# EAGLE design Control (EAGLE 9.5.2)
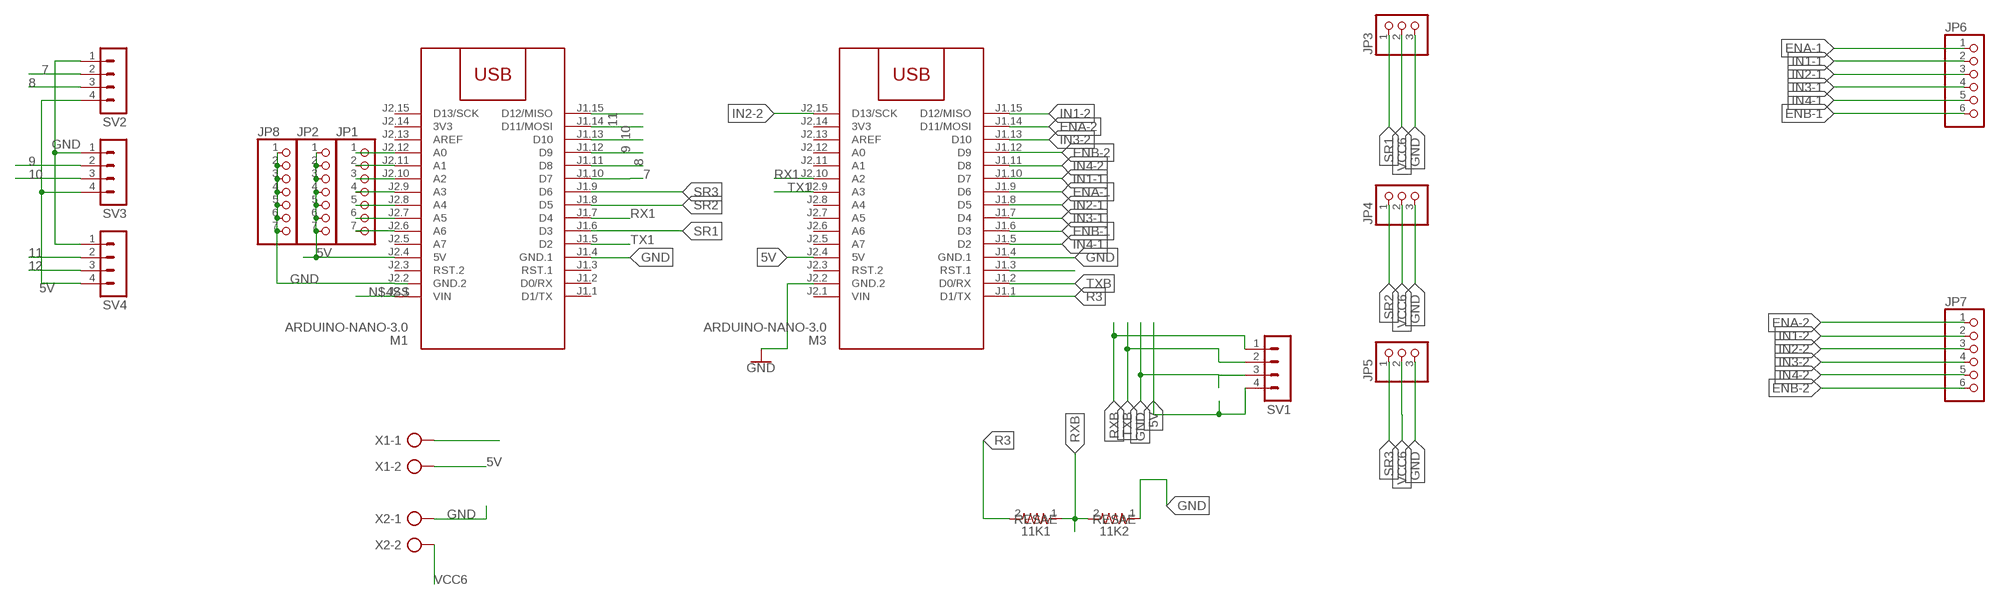
[diagram p0: schematic, sheet 1]

## Parts
11K1  RESAE  [RESAD846W63L520D250B]
11K2  RESAE  [RESAD846W63L520D250B]
JP1  PINHD-1X7  [1X07]
JP2  PINHD-1X7  [1X07]
JP3  PINHD-1X3  [1X03]
JP4  PINHD-1X3  [1X03]
JP5  PINHD-1X3  [1X03]
JP6  PINHD-1X6  [1X06]
JP7  PINHD-1X6  [1X06]
JP8  PINHD-1X7  [1X07]
M1  ARDUINO-NANO-3.0  [ARDUINO-NANO-3.0]
M3  ARDUINO-NANO-3.0  [ARDUINO-NANO-3.0]
SV1  MA04-1  [MA04-1]
SV2  MA04-1  [MA04-1]
SV3  MA04-1  [MA04-1]
SV4  MA04-1  [MA04-1]
X1  AK500/2-H  [AK500/2-H]
X2  AK500/2-H  [AK500/2-H]

## Nets
5V: JP2.1 JP2.2 JP2.3 JP2.4 JP2.5 JP2.6 JP2.7 M1.J2.4(5V) M3.J2.4(5V) SV1.4 SV2.4 SV3.4 SV4.4 X1.2
7: M1.J1.10(D7) SV2.2
8: M1.J1.11(D8) SV2.3
9: M1.J1.12(D9) SV3.2
10: M1.J1.13(D10) SV3.3
11: M1.J1.14(D11/MOSI) SV4.2
12: M1.J1.15(D12/MISO) SV4.3
ENA-1: JP6.1 M3.J1.9(D6)
ENA-2: JP7.1 M3.J1.14(D11/MOSI)
ENB-1: JP6.6 M3.J1.6(D3)
ENB-2: JP7.6 M3.J1.12(D9)
GND: 11K2.1 JP3.3 JP4.3 JP5.3 JP8.1 JP8.2 JP8.3 JP8.4 JP8.5 JP8.6 JP8.7 M1.J1.4(GND.1) M1.J2.2(GND.2) M3.J1.4(GND.1) M3.J2.2(GND.2) SV1.3 SV2.1 SV3.1 SV4.1 X1.1 X2.1
IN1-1: JP6.2 M3.J1.10(D7)
IN1-2: JP7.2 M3.J1.15(D12/MISO)
IN2-1: JP6.3 M3.J1.8(D5)
IN2-2: JP7.3 M3.J2.15(D13/SCK)
IN3-1: JP6.4 M3.J1.7(D4)
IN3-2: JP7.4 M3.J1.13(D10)
IN4-1: JP6.5 M3.J1.5(D2)
IN4-2: JP7.5 M3.J1.11(D8)
N$1: M3.J1.3(RST.1)
N$2: JP1.1 M1.J2.12(A0)
N$3: JP1.2 M1.J2.11(A1)
N$4: JP1.3 M1.J2.10(A2)
N$4SS: M1.J2.1(VIN)
N$5: JP1.4 M1.J2.9(A3)
N$6: JP1.5 M1.J2.8(A4)
N$13: JP1.6 M1.J2.7(A5)
N$14: JP1.7 M1.J2.6(A6)
R3: 11K1.2 M3.J1.1(D1/TX)
RX1: M1.J1.7(D4) M3.J2.10(A2)
RXB: 11K1.1 11K2.2 SV1.1
SR1: JP3.1 M1.J1.6(D3)
SR2: JP4.1 M1.J1.8(D5)
SR3: JP5.1 M1.J1.9(D6)
TX1: M1.J1.5(D2) M3.J2.9(A3)
TXB: M3.J1.2(D0/RX) SV1.2
VCC6: JP3.2 JP4.2 JP5.2 X2.2
Unconnected: M1.J1.1(D1/TX) M1.J1.2(D0/RX) M1.J1.3(RST.1) M1.J2.3(RST.2) M1.J2.5(A7) M1.J2.13(AREF) M1.J2.15(D13/SCK) M3.J2.3(RST.2) M3.J2.5(A7) M3.J2.6(A6) M3.J2.7(A5) M3.J2.8(A4) M3.J2.11(A1) M3.J2.12(A0) M3.J2.13(AREF)

## Power pins joined to a net without a drawn wire
3V3: M1.J2.14(3V3) M3.J2.14(3V3)
VIN: M3.J2.1(VIN)

## Library data of the parts
11K1 11K2 = SparkFun-Resistors:RESAE
JP1 JP2 JP8 = pinhead:PINHD-1X7: PIN HEADER
JP3-JP5 = pinhead:PINHD-1X3: PIN HEADER
JP6 JP7 = pinhead:PINHD-1X6: PIN HEADER
M1 M3 = diy-modules:ARDUINO-NANO-3.0: Arduino Nano 3.0 and compatible devices More details available here: https://www.arduino.cc/en/Main/ArduinoBoardNano Click here to find device on ebay.com <http://www.ebay.com/sch/arduino+nano>
SV1-SV4 = con-lstb:MA04-1: PIN HEADER; OC_FARNELL: unknown; OC_NEWARK: unknown
X1 X2 = con-ptr500:AK500/2-H: CONNECTOR Aug. 2004 / PTR Meßtechnik: Die Bezeichnung der Serie AK505 wurde geändert. Es handelt sich hierbei um AK500 in horizontaler Ausführung.; OC_FARNELL: unknown; OC_NEWARK: unknown

## Board
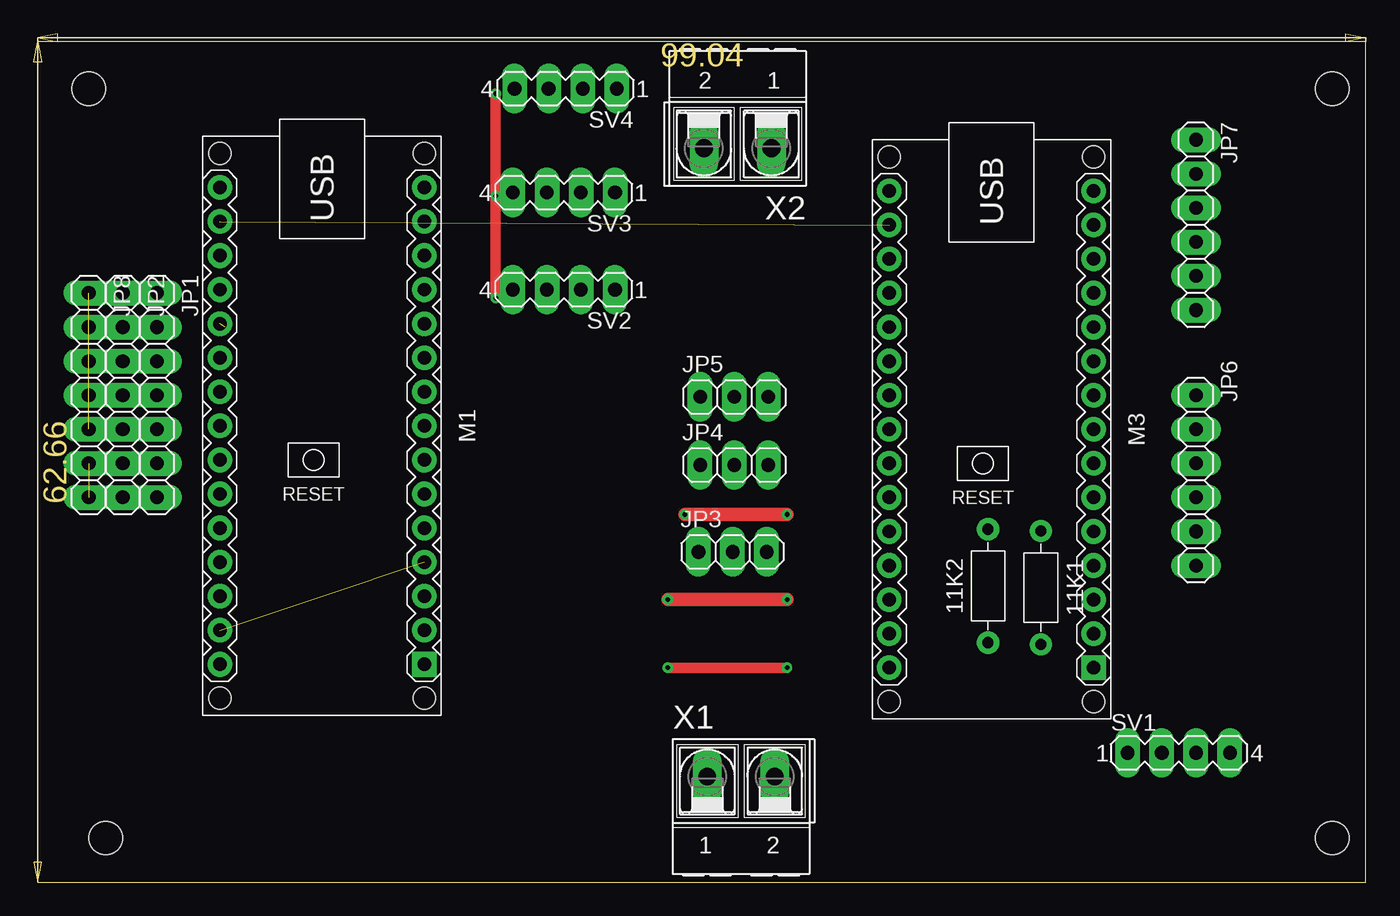
[diagram p1: board, top side]
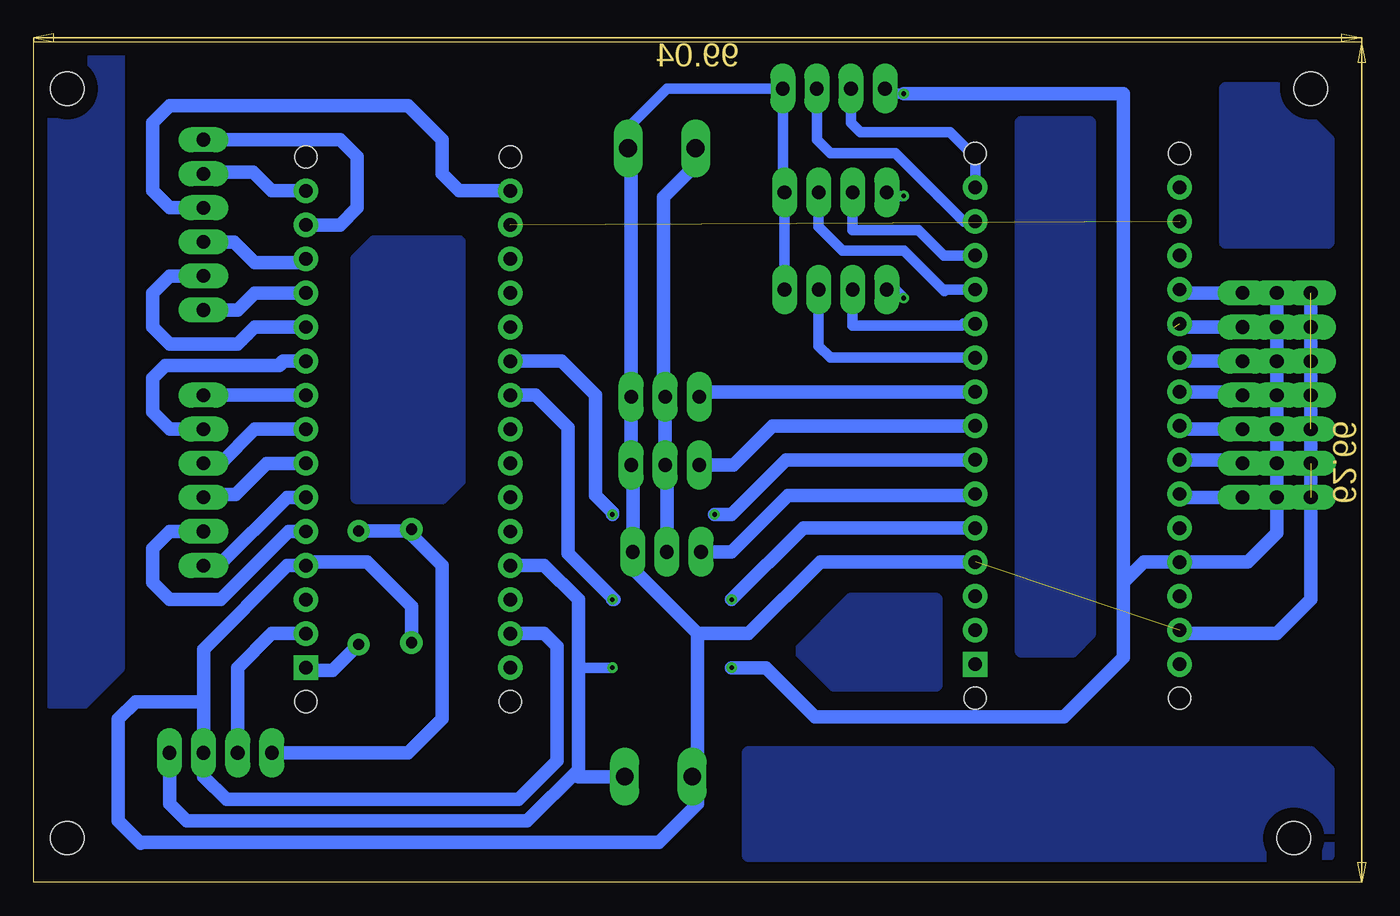
[diagram p2: board, bottom side, seen from below]

Size 99.04 x 62.66 mm. Coordinates in mm from the lower left corner, seen from the top.
Outline: 0,0 99.04,0 99.04,62.66 0,62.66 0,0
Copper layers (1*16): Top 0.035mm / dielectric 1.5mm / Bottom 0.035mm
Design rules "default *": minimum track width 6mil, minimum drill 0.35mm, track to track 0.6mm, track to pad 0.8mm, pad to pad 6mil, via to via 6mil, smd to smd 6mil, copper to edge 40mil, drill to drill 6mil, minimum pad ring 0.42mm, minimum via ring 8mil, stop-mask expansion 4mil, vias tented up to drill 0mil, thermal gap 10mil
Holes 2.5 mm at 3.81,59.18 5.08,3.3 96.52,3.3 96.52,59.18

### Footprints (pad centres in the part's own frame; a part is rotated, then mirrored left to right if it is on the bottom)
RESAD846W63L520D250B = drill 0.83 pad 1.43: 1 -4.23,0; 2 4.23,0
1X07 = drill 1.016 long: 1 -7.62,0; 2 -5.08,0; 3 -2.54,0; 4 0,0; 5 2.54,0; 6 5.08,0; 7 7.62,0
1X03 = drill 1.016 long: 1 -2.54,0; 2 0,0; 3 2.54,0
1X06 = drill 1.016 long: 1 -6.35,0; 2 -3.81,0; 3 -1.27,0; 4 1.27,0; 5 3.81,0; 6 6.35,0
ARDUINO-NANO-3.0 = drill 1 square: J1.1 17.78,7.62 | drill 1: J1.2 15.24,7.62; J1.3 12.7,7.62; J1.4 10.16,7.62; J1.5 7.62,7.62; J1.6 5.08,7.62; J1.7 2.54,7.62; J1.8 0,7.62; J1.9 -2.54,7.62; J1.10 -5.08,7.62; J1.11 -7.62,7.62; J1.12 -10.16,7.62; J1.13 -12.7,7.62; J1.14 -15.24,7.62; J1.15 -17.78,7.62; J2.1 17.78,-7.62; J2.2 15.24,-7.62; J2.3 12.7,-7.62; J2.4 10.16,-7.62; J2.5 7.62,-7.62; J2.6 5.08,-7.62; J2.7 2.54,-7.62; J2.8 0,-7.62; J2.9 -2.54,-7.62; J2.10 -5.08,-7.62; J2.11 -7.62,-7.62; J2.12 -10.16,-7.62; J2.13 -12.7,-7.62; J2.14 -15.24,-7.62; J2.15 -17.78,-7.62 | hole 1.651: -20.32,7.62; -20.32,-7.62; 20.32,-7.62; 20.32,7.62
MA04-1 = drill 1.016 long: 1 -3.81,0; 2 -1.27,0; 3 1.27,0; 4 3.81,0
AK500/2-H = drill 1.321 long: 1 -2.515,0; 2 2.515,0

### Placement (x,y rotation side)
11K1  74.8,21.97 270 top
11K2  70.87,22.1 90 top
JP1  8.89,36.32 270 top
JP2  6.35,36.32 270 top
JP3  51.82,24.64 0 top
JP4  51.94,31.11 0 top
JP5  51.94,36.19 0 top
JP6  86.36,29.97 270 top
JP7  86.36,49.02 270 top
JP8  3.81,36.32 270 top
M1  21.21,34.04 270 top
M3  71.12,33.78 270 top
SV1  85.09,9.65 0 top
SV2  39.24,44.2 180 top
SV3  39.24,51.44 180 top
SV4  39.37,59.18 180 top
X1  52.45,7.87 0 top
X2  52.2,54.74 180 top

### Tracks (layer width: path | path; a pad name or v marks a point on that pad's centre or on a via)
3V3  (1 unrouted)
5V  (via drill 0.35)
  Top 0.8: v34.16,58.8 v34.16,51.18 v34.16,43.56 | v55.88,16 v46.99,16
  Bottom 0.8: SV4.4 35.18,58.8 v34.16,58.8 | v34.16,51.18 35.05,51.18 35.12,51.12 SV3.4 | v34.16,43.56 34.8,44.2 35.56,44.2 | 58.42,16 v55.88,16
  Bottom 1: SV1.4 88.9,5.84 87.63,4.57 62.23,4.57 58.42,8.38 | 58.42,8.38 58.42,7.87 X1.2 | 58.42,8.38 58.42,16 58.42,21.08 60.96,23.62 M3.J2.4 | v46.99,16 44.45,16 40.77,12.32 22.23,12.32 17.78,16.76 17.78,22.35 | v34.16,58.8 17.78,58.8 17.78,22.35 | 17.78,22.35 16.26,23.88 M1.J2.4 8.51,23.88 6.35,26.04 JP2.7 JP2.6 JP2.5 JP2.4 JP2.3 JP2.2 JP2.1 | SV2.4 35.56,44.2
7
  Bottom 0.8: M1.J1.10 39.62,39.12 40.51,40 SV2.2
8
  Bottom 0.8: M1.J1.11 29.72,41.66 29.84,41.53 37.97,41.53 SV2.3
9
  Bottom 0.8: SV3.2 40.51,48.9 38.73,47.12 34.16,47.12 31.12,44.07 30.99,44.2 M1.J1.12
10
  Bottom 0.8: SV3.3 37.97,48.64 33.07,48.64 31.17,46.74 M1.J1.13
11
  Bottom 0.8: SV4.2 40.64,55.37 39.62,54.36 34.77,54.36 29.69,49.28 M1.J1.14
12
  Bottom 0.8: M1.J1.15 28.83,54.05 30.72,55.94 37.4,55.94 38.1,56.64 SV4.3
ENA-1
  Bottom 1: JP6.1 M3.J1.9
ENA-2
  Bottom 1: M3.J1.14 76.2,49.02 74.93,50.29 74.93,54.1 76.2,55.37 JP7.1
ENB-1
  Bottom 1: JP6.6 85.22,23.62 80.14,28.7 M3.J1.6
ENB-2
  Bottom 1: JP7.6 83.82,42.67 82.55,43.94 M3.J1.12
GND  (6 unrouted)
  Bottom 0.8: SV2.1 43.05,50.29 | 43.05,50.29 SV3.1 | 43.05,50.29 43.18,50.42 SV4.1 51.82,59.18 54.61,56.39 54.61,54.84 X2.1
  Bottom 1: 11K2.1 70.87,20.57 74.17,23.88 78.49,23.88 M3.J1.4 80.12,23.62 86.36,17.38 86.36,13.46 | 86.36,13.46 SV1.3 86.36,7.88 84.65,6.17 62.89,6.17 60.02,9.04 60.02,17.6 60.96,18.54 M3.J2.2 | 86.36,13.46 91.44,13.46 92.71,12.19 92.71,4.57 91.06,2.92 91.01,2.97 52.4,2.97 49.53,5.84 | JP5.3 JP4.3 54.36,30.99 JP3.3 54.36,23.37 49.53,18.54 | JP5.3 54.46,36.22 | 49.53,18.54 49.53,5.84 | X1.1 49.94,6.25 49.53,5.84 | X2.1 54.48,54.51 JP5.3 | M1.J1.4 40.39,23.88 45.72,18.54 49.53,18.54 | 13.46,18.92 M1.J2.2 13.34,18.54 6.35,18.54 3.81,21.08 JP8.7 JP8.1
IN1-1
  Bottom 1: M3.J1.10 80.41,38.86 80.74,38.53 89.23,38.53 90.17,37.59 90.17,35.05 88.9,33.78 JP6.2
IN1-2
  Bottom 1: JP7.2 86.23,52.96 82.68,52.96 81.28,51.56 M3.J1.15
IN2-1
  Bottom 1: JP6.3 85.09,31.24 82.55,33.78 M3.J1.8
IN2-2
  Bottom 1: JP7.3 88.9,50.29 90.17,51.56 90.17,56.64 88.9,57.91 71.12,57.91 68.58,55.37 68.58,52.83 67.31,51.56 M3.J2.15
IN3-1
  Bottom 1: JP6.4 86.14,28.93 83.98,28.93 81.67,31.24 M3.J1.7
IN3-2
  Bottom 1: JP7.4 84.07,47.75 82.55,46.23 78.99,46.23 M3.J1.13
IN4-1
  Bottom 1: JP6.5 88.9,26.16 90.17,24.89 90.17,22.35 88.9,21.08 85.09,21.08 80.01,26.16 M3.J1.5
IN4-2
  Bottom 1: M3.J1.11 82.55,41.4 83.82,40.13 88.9,40.13 90.17,41.4 90.17,43.94 88.9,45.21 JP7.5
N$2
  Bottom 1: M1.J2.12 13.34,43.94 JP1.1
N$3  (1 unrouted)
  Bottom 1: JP1.2 13.97,41.4
N$4
  Bottom 1: M1.J2.10 13.34,38.86 JP1.3
N$5
  Bottom 1: JP1.4 9.14,36.58 M1.J2.9
N$6
  Bottom 1: M1.J2.8 13.34,33.78 JP1.5
N$7
  pour Bottom: 45.72,9.65 3.81,9.65 2.54,8.38 2.54,2.03 45.72,2.03
N$8
  pour Bottom: 20.32,56.64 20.32,18.54 21.59,17.27 25.4,17.27 25.4,56.64 21.59,56.64
N$9
  pour Bottom: 74.93,28.7 68.58,28.7 67.31,29.97 67.31,47.75 73.66,47.75 74.93,46.48
N$10
  pour Bottom: 10.16,47.75 2.54,47.75 2.54,55.37 6.35,59.18 10.16,59.18 10.16,49.02
N$11
  pour Bottom: 92.71,61.72 92.71,16 95.25,13.46 97.79,13.46 97.79,61.72
N$12
  pour Bottom: 31.75,21.08 31.75,16 31.75,14.73 39.37,14.73 41.91,17.27 38.1,21.08
N$13
  Bottom 1: JP1.6 9.14,31.5 M1.J2.7
N$14
  Bottom 1: M1.J2.6 13.34,28.7 JP1.7
R3
  Bottom 1: M3.J1.1 78.54,15.8 76.74,15.8 11K1.2
RX1  (via drill 0.35)
  Top 1: v48.26,27.43 v55.88,27.43
  Bottom 1: M1.J1.7 42.93,31.5 46.99,27.43 v48.26,27.43 | v55.88,27.43 55.88,27.56 57.15,28.83 57.15,36.32 59.69,38.86 M3.J2.10
RXB
  Bottom 1: 11K1.1 70.99,26.2 11K2.2 70.87,25.91 68.58,23.62 68.58,12.19 71.12,9.65 SV1.1
SR1
  Bottom 1: JP3.1 46.99,24.64 42.8,28.83 28.96,28.83 M1.J1.6
SR2
  Bottom 1: M1.J1.8 43.94,34.04 46.86,31.11 JP4.1
SR3
  Bottom 1: M1.J1.9 49.02,36.58 JP5.1
TX1  (via drill 0.35)
  Top 1: v46.99,21.08 v55.88,21.08
  Bottom 1: M1.J1.5 41.66,26.42 v46.99,21.08 | v55.88,21.08 55.75,21.08 59.18,24.51 59.18,33.91 61.59,36.32 M3.J2.9
TXB
  Bottom 1: M3.J1.2 81.28,18.54 83.82,16 SV1.2
VCC6
  Bottom 1: X2.2 49.68,53.47 52.07,51.08 52.07,36.32 JP5.2 JP4.2 51.82,30.99 JP3.2